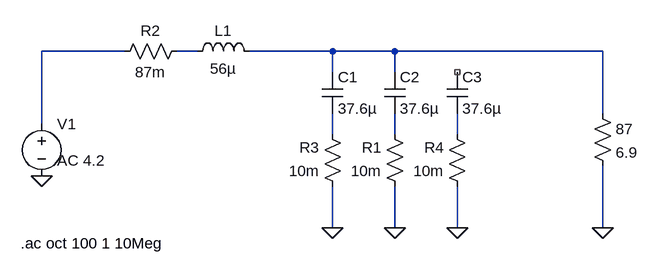
[diagram p0: schematic Vreg-filter-effective.asc]
Vreg-filter-effective.asc, the LTspice schematic file:
Version 4
SHEET 1 1004 680
WIRE 208 16 80 16
WIRE 320 16 288 16
WIRE 528 16 400 16
WIRE 624 16 528 16
WIRE 944 16 624 16
WIRE 528 48 528 16
WIRE 624 48 624 16
WIRE 944 112 944 16
WIRE 80 128 80 16
WIRE 528 144 528 112
WIRE 624 144 624 112
WIRE 720 144 720 112
WIRE 528 288 528 224
WIRE 624 288 624 224
WIRE 720 288 720 224
WIRE 944 288 944 192
FLAG 80 208 0
FLAG 528 288 0
FLAG 944 288 0
FLAG 624 288 0
FLAG 720 288 0
SYMBOL voltage 80 112 R0
WINDOW 3 24 44 Left 2
WINDOW 123 24 72 Left 2
WINDOW 39 0 0 Left 2
SYMATTR Value ""
SYMATTR Value2 AC 4.2
SYMATTR InstName V1
SYMBOL ind 304 32 R270
WINDOW 0 32 56 VTop 2
WINDOW 3 5 56 VBottom 2
SYMATTR InstName L1
SYMATTR Value 56µ
SYMBOL cap 512 48 R0
SYMATTR InstName C1
SYMATTR Value 37.6µ
SYMBOL res 928 96 R0
SYMATTR InstName 87
SYMATTR Value 6.9
SYMBOL res 304 0 R90
WINDOW 0 0 56 VBottom 2
WINDOW 3 32 56 VTop 2
SYMATTR InstName R2
SYMATTR Value 87m
SYMBOL res 544 240 R180
WINDOW 0 36 76 Left 2
WINDOW 3 36 40 Left 2
SYMATTR InstName R3
SYMATTR Value 10m
SYMBOL cap 608 48 R0
SYMATTR InstName C2
SYMATTR Value 37.6µ
SYMBOL res 640 240 R180
WINDOW 0 36 76 Left 2
WINDOW 3 36 40 Left 2
SYMATTR InstName R1
SYMATTR Value 10m
SYMBOL cap 704 48 R0
SYMATTR InstName C3
SYMATTR Value 37.6µ
SYMBOL res 736 240 R180
WINDOW 0 36 76 Left 2
WINDOW 3 36 40 Left 2
SYMATTR InstName R4
SYMATTR Value 10m
TEXT 48 312 Left 2 !.ac oct 100 1 10Meg

The netlist it stands for:
* Vreg-filter-effective.asc
V1 N001 0 AC 4.2
L1 N002 N003 56µ
C1 N003 N004 37.6µ
R§87 N003 0 6.9
R2 N002 N001 87m
R3 0 N004 10m
C2 N003 N005 37.6µ
R1 0 N005 10m
C3 NC_01 N006 37.6µ
R4 0 N006 10m
.ac oct 100 1 10Meg
.backanno
.end